# EAGLE schematic PSprogramboard (EAGLE 7.2.0)
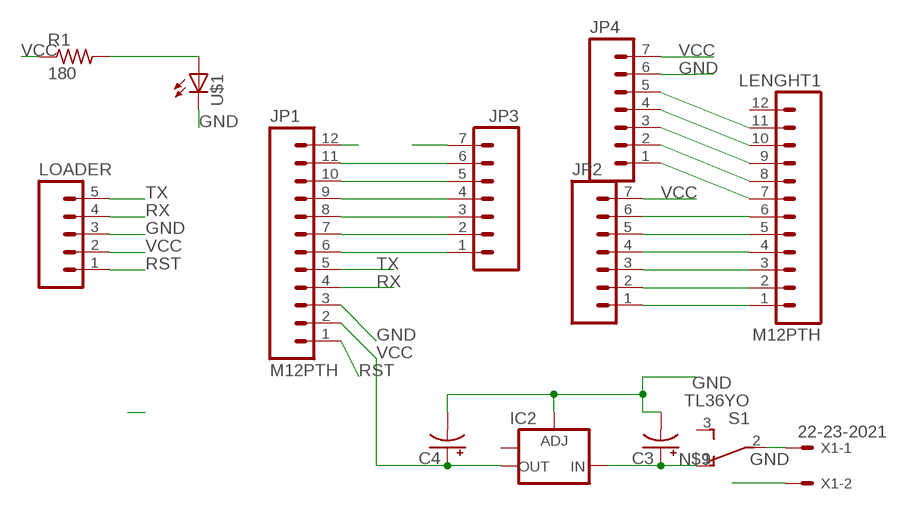
[diagram p0: schematic, sheet 1]

## Parts
C3  CAP_POLC  [PANASONIC_C]
C4  CAP_POLC  [PANASONIC_C]
IC2  V_REG_LM1117SOT223  [SOT223]
JP1  M12PTH  [1X12]
JP2  M07  [1X07]
JP3  M07  [1X07]
JP4  M07  [1X07]
LENGHT1  M12PTH  [1X12]
LOADER  M05PTH  [1X05]
R1  180  RESISTOR1206  [1206]
S1  TL36YO  [TL3XYO]
U$1  LED1206  [1206]
X1  22-23-2021  [22-23-2021]

## Nets
GND [power]: C3.- C4.- IC2.1(ADJ) JP1.3 JP1.11 JP1.12 JP2.6 JP3.6 JP4.6 LENGHT1.6 LOADER.3 U$1.2(C) X1.2
N$1: JP2.1 LENGHT1.1
N$2: JP1.8 JP3.3
N$3: S1.2(P) X1.1
N$4: JP1.10 JP3.5
N$5: JP1.9 JP3.4
N$6: JP2.2 LENGHT1.2
N$7: JP2.4 LENGHT1.4
N$8: JP1.7 JP3.2
N$9: C3.+ IC2.3(IN) S1.1(O)
N$10: JP2.3 LENGHT1.3
N$11: JP4.1 LENGHT1.7
N$12: JP2.5 LENGHT1.5
N$13: JP1.6 JP3.1
N$14: R1.2 U$1.1(A)
N$15: JP4.2 LENGHT1.8
N$16: JP4.3 LENGHT1.9
N$17: JP4.4 LENGHT1.10
N$18: JP4.5 LENGHT1.11
RST: JP1.1 LOADER.1
RX: JP1.4 LOADER.4
TX: JP1.5 LOADER.5
VCC [power]: C4.+ IC2.2(OUT) JP1.2 JP2.7 JP3.7 JP4.7 LOADER.2 R1.1
Unconnected: IC2.4(OUT) LENGHT1.12 S1.3(S)

## Library data of the parts
C3 C4 = 01_SparkFun:CAP_POL: Capacitor Polarized These are standard SMD and PTH capacitors. Normally 10uF, 47uF, and 100uF in electrolytic and tantalum varieties. Always verify the external diameter of the through hole cap, it varies with capacity, voltage, and manufacturer. The EIA devices should be standard.
IC2 = 01_SparkFun:V_REG_LM1117: Voltage Regulator LM1117 Standard adjustable voltage regulator but in SMD form. Spark Fun Electronics SKU : COM-00595
JP1 LENGHT1 = 01_SparkFun:M12: Header 12 Standard 12-pin 0.1" header. Use with straight break away headers (SKU : PRT-00116), right angle break away headers (PRT-00553), swiss pins (PRT-00743), machine pins (PRT-00117), and female headers (PRT-00115).
JP2-JP4 = 01_SparkFun:M07: Header 7 Standard 7-pin 0.1" header. Use with straight break away headers (SKU : PRT-00116), right angle break away headers (PRT-00553), swiss pins (PRT-00743), machine pins (PRT-00117), and female headers (PRT-00115). NOTES ON THE VARIANTS LOCK and LOCK_LONGPADS... This footprint was designed to help hold the alignment of a through-hole component (i.e. 7-pin header) while soldering it into place. You may notice that each hole has been shifted either up or down by 0.005 of an inch from it's more standard position (which is usually a perfectly straight line). This slight alteration caused the pins (the squares in the middle) to touch the edges of the holes. Because they are alternating, it causes a "brace" to hold the header in place. 0.005 has proven to be the perfect amount of "off-center" position when using our standard breakaway headers. Although looks a little odd when you look at the bare footprint, once you have a header in there, the alteration is very hard to notice. Also, if you push a header all the way into place, it is covered up entirely on the bottom side. This idea of altering the position of holes to aid alignment will be further integrated into the Sparkfun Library for other footprints. It can help hold any component with 3 or more connection pins.
LOADER = 01_SparkFun:M05: Header 5 Standard 5-pin 0.1" header. Use with straight break away headers (SKU : PRT-00116), right angle break away headers (PRT-00553), swiss pins (PRT-00743), machine pins (PRT-00117), and female headers (PRT-00115). Molex polarized connector foot print use with SKU : PRT-08230 with associated crimp pins and housings.
R1 = 01_FAB_Hello:RESISTOR
S1 = switch:TL36YO: TINY SWITCH ON - ON Source: http://www2.produktinfo.conrad.com/datenblaetter/700000-724999/705152-da-01-de-Subminiaturschalter_TL_36YO.pdf
U$1 = 01_FAB_Hello:LED
X1 = con-molex:22-23-2021: .100" (2.54mm) Center Header - 2 Pin; MF: MOLEX; MPN: 22-23-2021; OC_FARNELL: 1462926; OC_NEWARK: 25C3832

## Net classes
1 power: width 0.406 mm, clearance 1.016 mm
2 signal: width 0.203 mm, clearance 0.406 mm